# EAGLE schematic RelayDelayAtmel (EAGLE 6.5.0)
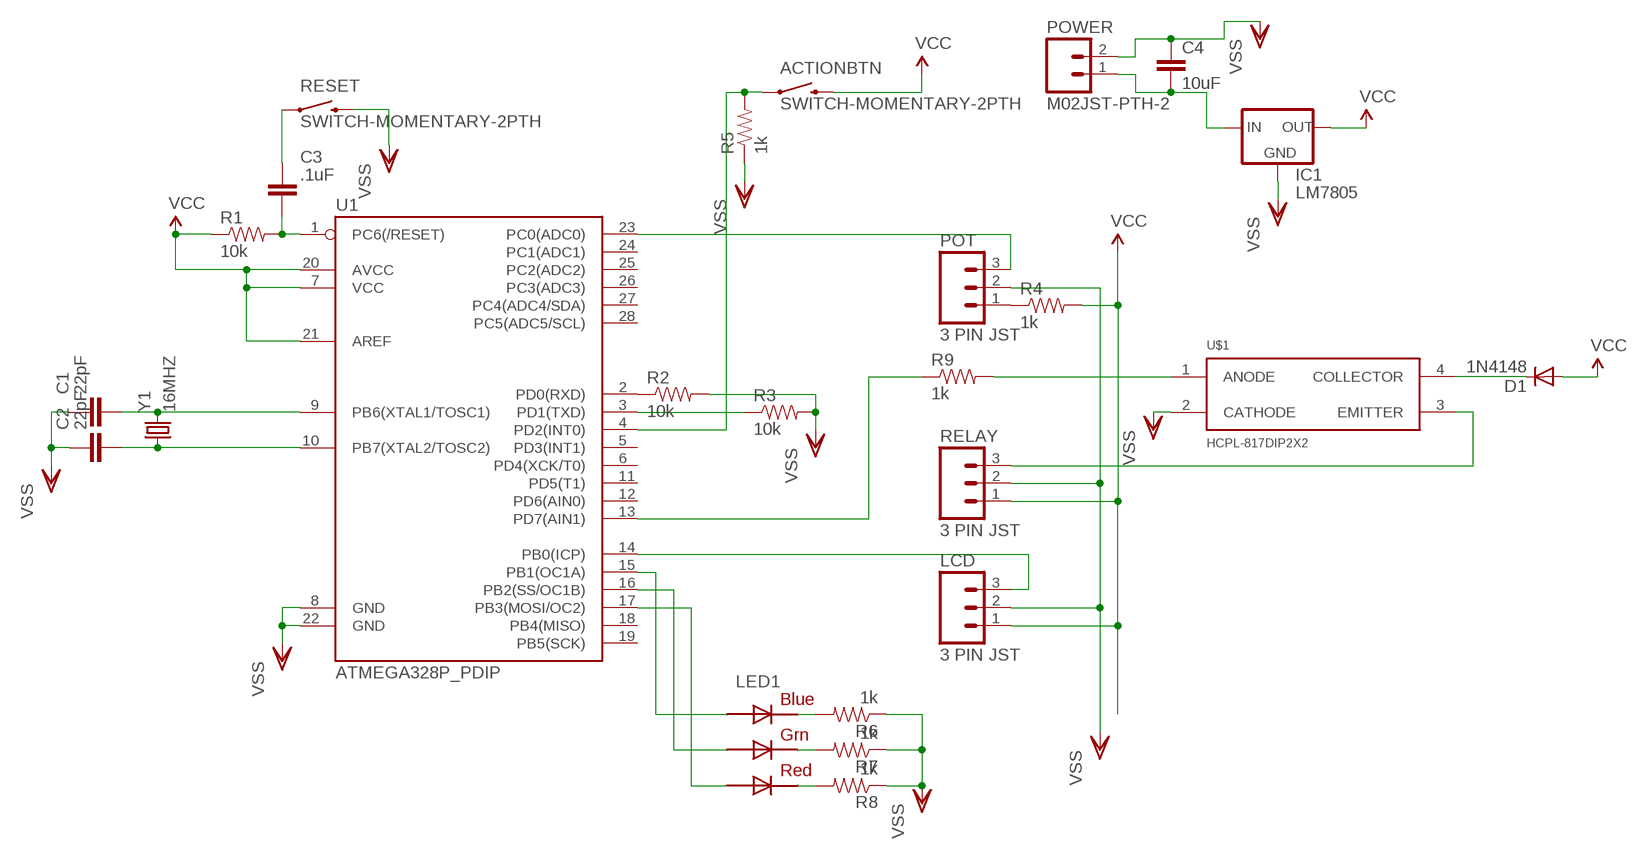
[diagram p0: schematic, sheet 1]

## Parts
ACTIONBTN  SWITCH-MOMENTARY-2PTH  [TACTILE-PTH]
C1  22pF  CAPACITOR_NPOL-PTH_0.1"  [C0.1PTH]
C2  22pF  CAPACITOR_NPOL-PTH_0.1"  [C0.1PTH]
C3  .1uF  CAPACITOR_NPOL-PTH_0.1"  [C0.1PTH]
C4  10uF  CAPEZ  [CAP-PTH-SMALLEZ]
D1  1N4148  DIODE  [DIODE-1N4001-KIT]
IC1  LM7805  V_REG_78XX-TO-220  [TO-220-ALT]
LCD  3 PIN JST  M03JST-PTH  [JST-3-PTH]
LED1  RGBLED5050  [RGBLED5050]
POT  3 PIN JST  M03JST-PTH  [JST-3-PTH]
POWER  M02JST-PTH-2  [JST-2-PTH]
R1  10k  RESISTORAXIAL-0.3  [AXIAL-0.3]
R2  10k  RESISTORAXIAL-0.3  [AXIAL-0.3]
R3  10k  RESISTORAXIAL-0.3  [AXIAL-0.3]
R4  1k  RESISTORAXIAL-0.3  [AXIAL-0.3]
R5  1k  RESISTORAXIAL-0.3  [AXIAL-0.3]
R6  1k  RESISTORAXIAL-0.3  [AXIAL-0.3]
R7  1k  RESISTORAXIAL-0.3  [AXIAL-0.3]
R8  1k  RESISTORAXIAL-0.3  [AXIAL-0.3]
R9  1k  RESISTORAXIAL-0.3  [AXIAL-0.3]
RELAY  3 PIN JST  M03JST-PTH  [JST-3-PTH]
RESET  SWITCH-MOMENTARY-2PTH  [TACTILE-PTH]
U1  ATMEGA328P_PDIP  [DIL28-3]
U$1  HCPL-817DIP2X2  [DIP]
Y1  16MHZ  CRYSTALHC49US  [HC49US]

## Nets
N$1: C1.2 U1.9(PB6(XTAL1/TOSC1)) Y1.2
N$2: C2.2 U1.10(PB7(XTAL2/TOSC2)) Y1.1
N$3: C3.2 R1.P$2 U1.1(PC6(/RESET))
N$4: C3.1 RESET.1
N$5: R3.P$1 U1.3(PD1(TXD))
N$6: R2.P$1 U1.2(PD0(RXD))
N$7: C4.2 IC1.IN POWER.1
N$8: D1.C U$1.4(COLLECTOR)
N$9: RELAY.3 U$1.3(EMITTER)
N$10: POT.1 R4.P$1
N$11: ACTIONBTN.1 R5.P$2 U1.4(PD2(INT0))
N$12: LED1.4(BLUE_C) R6.P$2
N$13: LED1.6(GREEN_C) R7.P$2
N$14: LED1.5(RED_C) R8.P$2
N$15: LED1.3(BLUE_A) U1.15(PB1(OC1A))
N$16: LED1.1(GREEN_A) U1.16(PB2(SS/OC1B))
N$17: LED1.2(RED_A) U1.17(PB3(MOSI/OC2))
N$18: POT.3 U1.23(PC0(ADC0))
N$19: LCD.3 U1.14(PB0(ICP))
N$20: R9.P$2 U$1.1(ANODE)
N$21: R9.P$1 U1.13(PD7(AIN1))
VCC: ACTIONBTN.3 D1.A IC1.OUT LCD.1 R1.P$1 R4.P$2 RELAY.1 U1.7(VCC) U1.20(AVCC) U1.21(AREF)
VSS: C1.1 C2.1 C4.1 IC1.GND LCD.2 POT.2 POWER.2 R2.P$2 R3.P$2 R5.P$1 R6.P$1 R7.P$1 R8.P$1 RELAY.2 RESET.3 U1.8(GND) U1.22(GND) U$1.2(CATHODE)
Unconnected: U1.5(PD3(INT1)) U1.6(PD4(XCK/T0)) U1.11(PD5(T1)) U1.12(PD6(AIN0)) U1.18(PB4(MISO)) U1.19(PB5(SCK)) U1.24(PC1(ADC1)) U1.25(PC2(ADC2)) U1.26(PC3(ADC3)) U1.27(PC4(ADC4/SDA)) U1.28(PC5(ADC5/SCL))

## Library data of the parts
ACTIONBTN RESET = SparkFun-Electromechanical:SWITCH-MOMENTARY-2: Various NO switches- pushbuttons, reed, etc
C1-C3 = dp_devices:CAPACITOR_NPOL: Non-Polarized capacitor in various packages
C4 = SparkFun-Capacitors:CAP: Capacitor Standard 0603 ceramic capacitor, and 0.1" leaded capacitor.
D1 = SparkFun-DiscreteSemi:DIODE: Diode These are standard reverse protection diodes and small signal diodes. SMA package can handle up to about 1A. SOD-323 can handle about 200mA. What the SOD-323 package when ordering, there are some mfgs out there that are 5-pin packages.
IC1 = SparkFun-PowerIC:V_REG_78XX: Voltage Regulator Standard 7805 5V regulator. IGO (Input Ground Output). Spark Fun Electronics SKU : COM-00107
LCD POT RELAY = SparkFun-Connectors:M03: Header 3 Standard 3-pin 0.1" header. Use with straight break away headers (SKU : PRT-00116), right angle break away headers (PRT-00553), swiss pins (PRT-00743), machine pins (PRT-00117), and female headers (PRT-00115). Molex polarized connector foot print use with SKU : PRT-08232 with associated crimp pins and housings.; SKU: PRT-09915
LED1 = adafruit:RGBLED: For 5050 RGB LEDs, the order of the LEDs may vary from one manufacturer to another!
POWER = SparkFun-Connectors:M02: Standard 2-pin 0.1" header. Use with - straight break away headers ( PRT-00116) - right angle break away headers (PRT-00553) - swiss pins (PRT-00743) - machine pins (PRT-00117) - female headers (PRT-00115) Molex polarized connector foot print use with: PRT-08233 with associated crimp pins and housings. 2.54_SCREWTERM for use with PRT-10571. 3.5mm Screw Terminal footprints for PRT-08084 5mm Screw Terminal footprints for use with PRT-08433; SKU: PRT-09914
R1-R9 = SparkFun-Passives:RESISTOR: Resistor Basic schematic elements and footprints for 0603, 1206, and PTH resistors.
U1 = SparkFun-DigitalIC:ATMEGA328P_PDIP: uC used in the Arduino 32kb flash, 1k EEPROM, 2k SRAM This is the through-hole version of this chip.
U$1 = OptoIsolator HCPL-817:HCPL-817: The HCPL-817 contains a light emitting diode optically coupled to a phototransistor. It is packaged in a 4-pin DIP package and available in wide-lead spacing option and lead bend SMD option. Input-output isolation voltage is 5000 Vrms. Response time, tr, is typically 4 μs and minimum CTR is 50% at input current of 5 mA.
Y1 = SparkFun-FreqCtrl:CRYSTAL: Various standard crystals. Proven footprints. Spark Fun Electronics SKU : COM-00534